# EAGLE design IonSensorRevB (EAGLE 9.6.2)
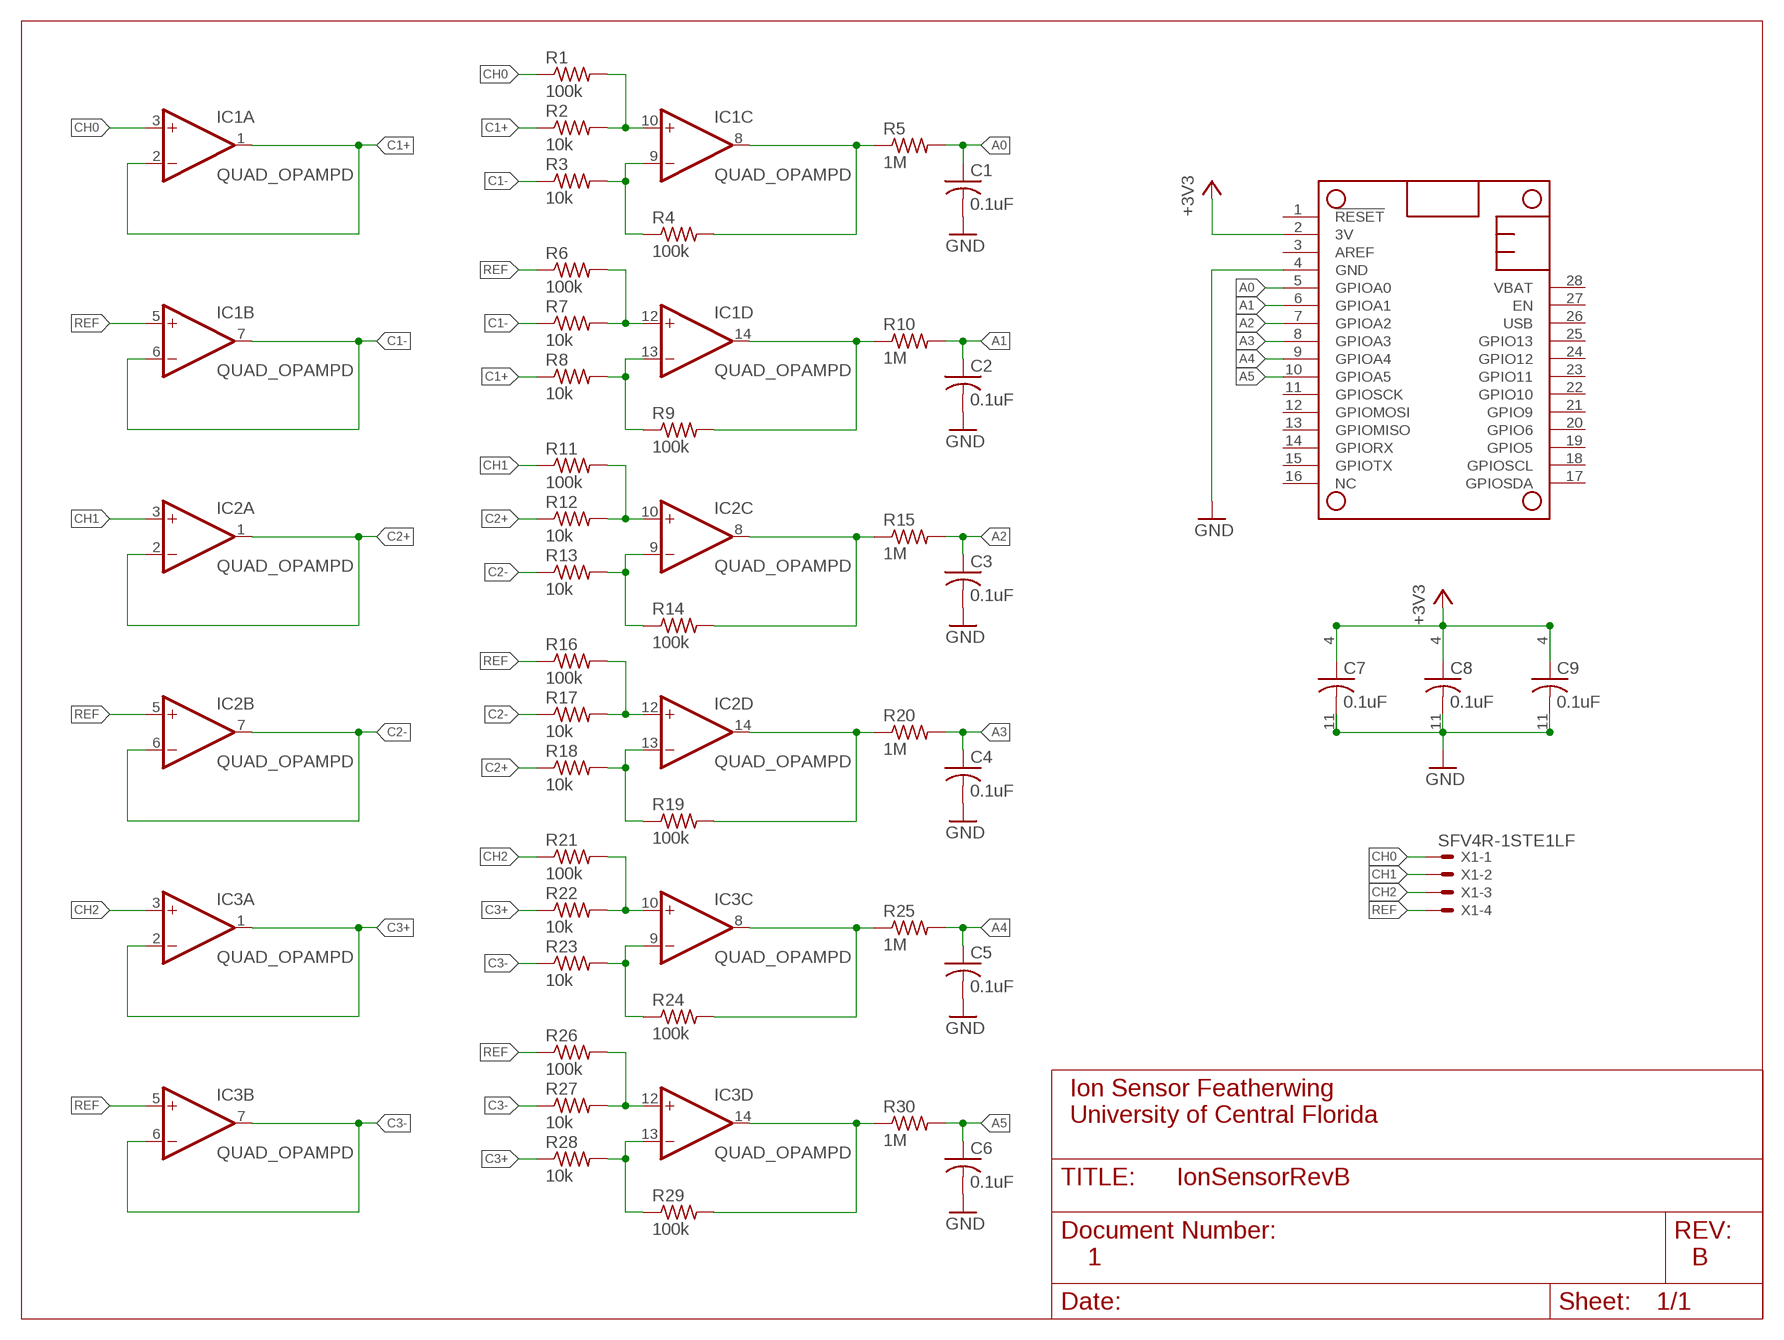
[diagram p0: schematic, sheet 1]

## Parts
C1  0.1uF  C-USC0402  [C0402]
C2  0.1uF  C-USC0402  [C0402]
C3  0.1uF  C-USC0402  [C0402]
C4  0.1uF  C-USC0402  [C0402]
C5  0.1uF  C-USC0402  [C0402]
C6  0.1uF  C-USC0402  [C0402]
C7  0.1uF  C-USC0402  [C0402]
C8  0.1uF  C-USC0402  [C0402]
C9  0.1uF  C-USC0402  [C0402]
IC1  QUAD_OPAMPD  [SO14]
IC2  QUAD_OPAMPD  [SO14]
IC3  QUAD_OPAMPD  [SO14]
MS1  FEATHERWING  [FEATHERWING]
R1  100k  R-US_R0402  [R0402]
R2  10k  R-US_R0402  [R0402]
R3  10k  R-US_R0402  [R0402]
R4  100k  R-US_R0402  [R0402]
R5  1M  R-US_R0402  [R0402]
R6  100k  R-US_R0402  [R0402]
R7  10k  R-US_R0402  [R0402]
R8  10k  R-US_R0402  [R0402]
R9  100k  R-US_R0402  [R0402]
R10  1M  R-US_R0402  [R0402]
R11  100k  R-US_R0402  [R0402]
R12  10k  R-US_R0402  [R0402]
R13  10k  R-US_R0402  [R0402]
R14  100k  R-US_R0402  [R0402]
R15  1M  R-US_R0402  [R0402]
R16  100k  R-US_R0402  [R0402]
R17  10k  R-US_R0402  [R0402]
R18  10k  R-US_R0402  [R0402]
R19  100k  R-US_R0402  [R0402]
R20  1M  R-US_R0402  [R0402]
R21  100k  R-US_R0402  [R0402]
R22  10k  R-US_R0402  [R0402]
R23  10k  R-US_R0402  [R0402]
R24  100k  R-US_R0402  [R0402]
R25  1M  R-US_R0402  [R0402]
R26  100k  R-US_R0402  [R0402]
R27  10k  R-US_R0402  [R0402]
R28  10k  R-US_R0402  [R0402]
R29  100k  R-US_R0402  [R0402]
R30  1M  R-US_R0402  [R0402]
X1  SFV4R-1STE1LF  [SFV4R-1STE1LF]

## Nets
+3V3: C7.1 C8.1 C9.1 IC1.4(P:V+) IC2.4(P:V+) IC3.4(P:V+) MS1.2(3V)
A0: C1.1 MS1.5(GPIOA0) R5.2
A1: C2.1 MS1.6(GPIOA1) R10.2
A2: C3.1 MS1.7(GPIOA2) R15.2
A3: C4.1 MS1.8(GPIOA3) R20.2
A4: C5.1 MS1.9(GPIOA4) R25.2
A5: C6.1 MS1.10(GPIOA5) R30.2
C1+: IC1.1(A:OUT) IC1.2(A:-IN) R2.1 R8.1
C1-: IC1.6(B:-IN) IC1.7(B:OUT) R3.1 R7.1
C2+: IC2.1(A:OUT) IC2.2(A:-IN) R12.1 R18.1
C2-: IC2.6(B:-IN) IC2.7(B:OUT) R13.1 R17.1
C3+: IC3.1(A:OUT) IC3.2(A:-IN) R22.1 R28.1
C3-: IC3.6(B:-IN) IC3.7(B:OUT) R23.1 R27.1
CH0: IC1.3(A:+IN) R1.1 X1.1
CH1: IC2.3(A:+IN) R11.1 X1.2
CH2: IC3.3(A:+IN) R21.1 X1.3
GND: C1.2 C2.2 C3.2 C4.2 C5.2 C6.2 C7.2 C8.2 C9.2 IC1.11(P:V-) IC2.11(P:V-) IC3.11(P:V-) MS1.4(GND)
N$1: IC1.10(C:+IN) R1.2 R2.2
N$2: IC1.9(C:-IN) R3.2 R4.1
N$3: IC3.10(C:+IN) R21.2 R22.2
N$4: IC1.12(D:+IN) R6.2 R7.2
N$5: IC1.8(C:OUT) R4.2 R5.1
N$6: IC1.13(D:-IN) R8.2 R9.1
N$7: IC3.9(C:-IN) R23.2 R24.1
N$8: IC2.10(C:+IN) R11.2 R12.2
N$9: IC2.9(C:-IN) R13.2 R14.1
N$10: IC1.14(D:OUT) R9.2 R10.1
N$11: IC2.12(D:+IN) R16.2 R17.2
N$12: IC3.12(D:+IN) R26.2 R27.2
N$13: IC2.13(D:-IN) R18.2 R19.1
N$14: IC2.8(C:OUT) R14.2 R15.1
N$15: IC3.13(D:-IN) R28.2 R29.1
N$16: IC2.14(D:OUT) R19.2 R20.1
N$17: IC3.8(C:OUT) R24.2 R25.1
N$18: IC3.14(D:OUT) R29.2 R30.1
REF: IC1.5(B:+IN) IC2.5(B:+IN) IC3.5(B:+IN) R6.1 R16.1 R26.1 X1.4
Unconnected: MS1.1(!RESET) MS1.3(AREF) MS1.11(GPIOSCK) MS1.12(GPIOMOSI) MS1.13(GPIOMISO) MS1.14(GPIORX) MS1.15(GPIOTX) MS1.16(NC) MS1.17(GPIOSDA) MS1.18(GPIOSCL) MS1.19(GPIO5) MS1.20(GPIO6) MS1.21(GPIO9) MS1.22(GPIO10) MS1.23(GPIO11) MS1.24(GPIO12) MS1.25(GPIO13) MS1.26(USB) MS1.27(EN) MS1.28(VBAT)

## Notes on the sheet
- Ion Sensor Featherwing
  University of Central Florida
- 1 | B

## Library data of the parts
C1-C9 = adafruit:C-US: CAPACITOR, American symbol
IC1-IC3 = adafruit:QUAD_OPAMP: OP AMP Standard quad package
MS1 = adafruit:FEATHERWING
R1-R30 = adafruit:R-US_: RESISTOR, American symbol
X1 = adafruit:SFV4R-1STE1LF: FPC Connector ZIF for SMT 0.5mm SFV4R-1STE1LF Useful as the LED backlight connector for a PSP display

## Net classes
0 default: width 0.254 mm

## Board
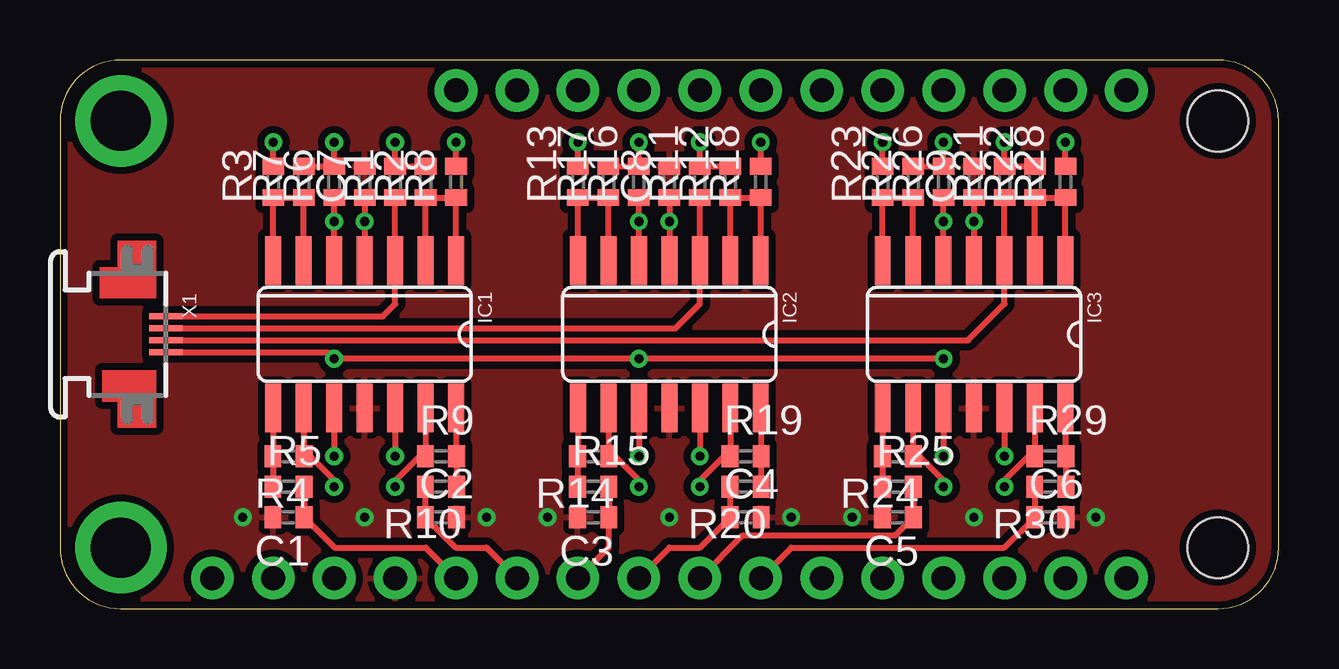
[diagram p1: board, top side]
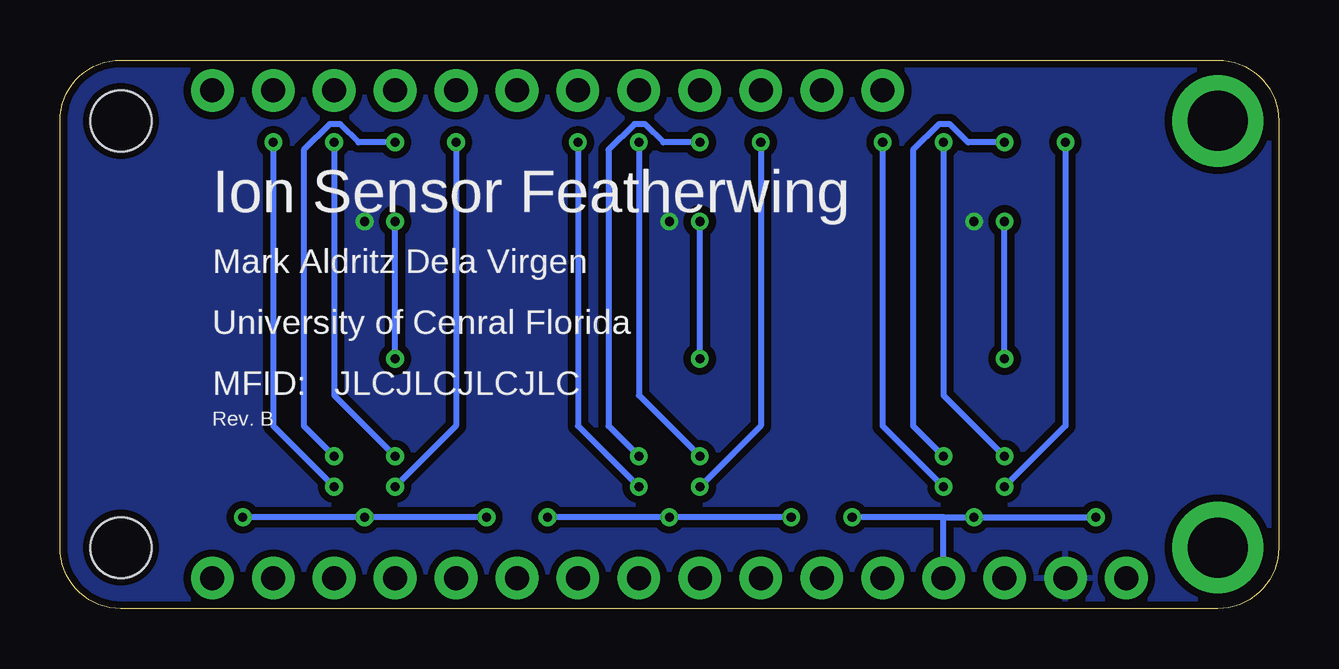
[diagram p2: board, bottom side, seen from below]

Size 50.8 x 22.86 mm. Coordinates in mm from the lower left corner, seen from the top.
Copper layers (1*16): Top 0.035mm / dielectric 1.5mm / Bottom 0.035mm
Design rules "SparkFun-2-Layer-General-JLCPCB": minimum track width 7mil, minimum drill 0.3mm, track to track 7mil, track to pad 7mil, pad to pad 7mil, via to via 7mil, smd to smd 7mil, copper to edge 7mil, drill to drill 7mil, minimum pad ring 7mil, minimum via ring 7mil, stop-mask expansion 3mil, vias tented up to drill 25mil, thermal gap 10mil

### Footprints (pad centres in the part's own frame; a part is rotated, then mirrored left to right if it is on the bottom)
C0402 = smd 0.7 x 0.9: 1 -0.65,0; 2 0.65,0
SO14 = smd 0.66 x 2.032: 1 -3.81,-3.073; 2 -2.54,-3.073; 3 -1.27,-3.073; 4 0,-3.073; 5 1.27,-3.073; 6 2.54,-3.073; 7 3.81,-3.073; 8 3.81,3.073; 9 2.54,3.073; 10 1.27,3.073; 11 0,3.073; 12 -1.27,3.073; 13 -2.54,3.073; 14 -3.81,3.073
FEATHERWING = drill 1 pad 1.778: 1 6.35,1.27; 2 8.89,1.27; 3 11.43,1.27; 4 13.97,1.27; 5 16.51,1.27; 6 19.05,1.27; 7 21.59,1.27; 8 24.13,1.27; 9 26.67,1.27; 10 29.21,1.27; 11 31.75,1.27; 12 34.29,1.27; 13 36.83,1.27; 14 39.37,1.27; 15 41.91,1.27; 16 44.45,1.27; 17 44.45,21.59; 18 41.91,21.59; 19 39.37,21.59; 20 36.83,21.59; 21 34.29,21.59; 22 31.75,21.59; 23 29.21,21.59; 24 26.67,21.59; 25 24.13,21.59; 26 21.59,21.59; 27 19.05,21.59; 28 16.51,21.59 | drill 2.5 pad 3.81: P$1 2.54,20.32; P$2 2.54,2.54 | hole 2.54: 48.26,20.32; 48.26,2.54
R0402 = smd 0.7 x 0.9: 1 -0.65,0; 2 0.65,0
SFV4R-1STE1LF = smd 0.25 x 1.4: 1 -0.75,0.6; 2 -0.25,0.6; 3 0.25,0.6; 4 0.75,0.6

### Placement (x,y rotation side)
C1  9.53,3.81 180 top
C2  15.88,3.81 0 top
C3  22.23,3.81 180 top
C4  28.57,3.81 0 top
C5  34.92,3.81 180 top
C6  41.27,3.81 0 top
C7  12.7,17.78 90 top
C8  25.4,17.78 90 top
C9  38.1,17.78 90 top
IC1  12.7,11.43 180 top
IC2  25.4,11.43 180 top
IC3  38.1,11.43 180 top
MS1  0,0 0 top
R1  13.97,17.78 90 top
R2  15.24,17.78 90 top
R3  8.89,17.78 90 top
R4  9.53,6.35 180 top
R5  9.53,5.08 0 top
R6  11.43,17.78 90 top
R7  10.16,17.78 90 top
R8  16.51,17.78 90 top
R9  15.88,6.35 0 top
R10  15.88,5.08 180 top
R11  26.67,17.78 90 top
R12  27.94,17.78 90 top
R13  21.59,17.78 90 top
R14  22.23,6.35 180 top
R15  22.23,5.08 0 top
R16  24.13,17.78 90 top
R17  22.86,17.78 90 top
R18  29.21,17.78 90 top
R19  28.57,6.35 0 top
R20  28.57,5.08 180 top
R21  39.37,17.78 90 top
R22  40.64,17.78 90 top
R23  34.29,17.78 90 top
R24  34.92,6.35 180 top
R25  34.92,5.08 0 top
R26  36.83,17.78 90 top
R27  35.56,17.78 90 top
R28  41.91,17.78 90 top
R29  41.27,6.35 0 top
R30  41.27,5.08 180 top
X1  3.81,11.43 270 top

### Tracks (layer width: path | path; a pad name or v marks a point on that pad's centre or on a via)
+3V3  (via drill 0.38)
  Top 0.254: C7.1 v12.7,16.13 IC1.4 | C8.1 v25.4,16.13 IC2.4 | C9.1 v38.1,16.13 IC3.4
  pour Bottom (isolate 0.305): 0,0 50.8,0 50.8,22.86 0,22.86
A0
  Top 0.254: R5.2 C1.1 11.45,2.54 15.24,2.54 MS1.5
A1
  Top 0.254: R10.2 C2.1 16.5,2.54 17.78,2.54 MS1.6
A2
  Top 0.254: R15.2 C3.1 22.88,2.56 MS1.7
A3
  Top 0.254: R20.2 C4.1 27.93,3.79 26.67,2.54 25.4,2.54 MS1.8
A4
  Top 0.254: R25.2 C5.1 34.81,3.05 28.45,3.05 MS1.9
A5
  Top 0.254: R30.2 C6.1 40.62,3.79 39.37,2.54 30.48,2.54 MS1.10
C1+
  Top 0.254: IC1.2 R2.1 R8.1 IC1.1
C1-
  Top 0.254: IC1.7 R3.1 R7.1 IC1.6
C2+
  Top 0.254: IC2.2 R12.1 R18.1 IC2.1
C2-
  Top 0.254: IC2.7 R13.1 R17.1 IC2.6
C3+
  Top 0.254: IC3.2 R22.1 R28.1 IC3.1
C3-
  Top 0.254: IC3.7 R23.1 R27.1 IC3.6
CH0
  Top 0.254: R1.1 IC1.3 13.97,12.7 13.45,12.18 X1.1
CH1
  Top 0.254: R11.1 IC2.3 26.67,12.7 25.65,11.68 X1.2
CH2
  Top 0.254: R21.1 IC3.3 39.37,12.7 37.85,11.18 X1.3
GND  (via drill 0.38)
  Bottom 0.254: MS1.4 13.97,3.81 | 13.97,3.81 v12.7,3.81 v7.62,3.81 | 13.97,3.81 v17.78,3.81 | v20.32,3.81 v25.4,3.81 v30.48,3.81 | v33.02,3.81 v38.1,3.81 v43.18,3.81
  pour Top (isolate 0.305): 0,0 50.8,0 50.8,22.86 0,22.86
N$1  (via drill 0.38)
  Top 0.254: R2.2 R1.2 v13.97,19.43 | IC1.10 v11.43,6.35
  Bottom 0.254: v13.97,19.43 13.97,8.89 v11.43,6.35
N$2  (via drill 0.38)
  Top 0.254: IC1.9 10.16,6.37 R4.1 10.43,6.35 11.43,5.35 v11.43,5.08 | R3.2 v8.89,19.43
  Bottom 0.254: v11.43,5.08 8.89,7.62 v8.89,19.43
N$3  (via drill 0.38)
  Top 0.254: R22.2 R21.2 v39.37,19.43 | IC3.10 v36.83,6.35
  Bottom 0.254: v39.37,19.43 39.37,8.89 v36.83,6.35
N$4  (via drill 0.38)
  Top 0.254: R7.2 R6.2 v11.43,19.43 | IC1.12 v13.97,6.35
  Bottom 0.254: v13.97,6.35 15.24,7.62 15.24,19.11 14.16,20.19 13.72,20.19 12.95,19.43 v11.43,19.43
N$5
  Top 0.254: IC1.8 8.89,6.37 R4.2 R5.1
N$6  (via drill 0.38)
  Top 0.254: IC1.13 15.24,6.37 R9.1 14.99,6.35 13.97,5.33 v13.97,5.08 | R8.2 v16.51,19.43
  Bottom 0.254: v16.51,19.43 16.51,7.62 v13.97,5.08
N$7  (via drill 0.38)
  Top 0.254: IC3.9 35.56,6.37 R24.1 35.83,6.35 36.83,5.35 v36.83,5.08 | R23.2 v34.29,19.43
  Bottom 0.254: v36.83,5.08 34.29,7.62 v34.29,19.43
N$8  (via drill 0.38)
  Top 0.254: R12.2 R11.2 v26.67,19.43 | IC2.10 v24.13,6.35
  Bottom 0.254: v26.67,19.43 26.67,8.89 v24.13,6.35
N$9  (via drill 0.38)
  Top 0.254: IC2.9 22.86,6.37 R14.1 23.13,6.35 24.13,5.35 v24.13,5.08 | R13.2 v21.59,19.43
  Bottom 0.254: v24.13,5.08 21.59,7.62 v21.59,19.43
N$10
  Top 0.254: IC1.14 16.51,6.37 R9.2 R10.1
N$11  (via drill 0.38)
  Top 0.254: R17.2 R16.2 v24.13,19.43 | IC2.12 v26.67,6.35
  Bottom 0.254: v26.67,6.35 27.94,7.62 27.94,19.11 26.86,20.19 26.42,20.19 25.65,19.43 v24.13,19.43
N$12  (via drill 0.38)
  Top 0.254: R27.2 R26.2 v36.83,19.43 | IC3.12 v39.37,6.35
  Bottom 0.254: v39.37,6.35 40.64,7.62 40.64,19.11 39.56,20.19 39.12,20.19 38.35,19.43 v36.83,19.43
N$13  (via drill 0.38)
  Top 0.254: IC2.13 27.94,6.37 R19.1 27.67,6.35 26.67,5.35 v26.67,5.08 | R18.2 v29.21,19.43
  Bottom 0.254: v29.21,19.43 29.21,7.62 v26.67,5.08
N$14
  Top 0.254: IC2.8 21.59,6.37 R14.2 R15.1
N$15  (via drill 0.38)
  Top 0.254: IC3.13 40.64,6.37 R29.1 40.37,6.35 39.37,5.35 v39.37,5.08 | R28.2 v41.91,19.43
  Bottom 0.254: v41.91,19.43 41.91,7.62 v39.37,5.08
N$16
  Top 0.254: IC2.14 29.21,6.37 R19.2 R20.1
N$17
  Top 0.254: IC3.8 34.29,6.37 R24.2 R25.1
N$18
  Top 0.254: IC3.14 41.91,6.37 R29.2 R30.1
REF  (via drill 0.38)
  Top 0.254: IC1.5 v11.43,16.13 R6.1 | IC2.5 v24.13,16.13 R16.1 | IC3.5 v36.83,16.13 R26.1 | X1.4 11.16,10.68 v11.43,10.41 v24.13,10.41 v36.83,10.41
  Bottom 0.254: v11.43,10.41 v11.43,16.13 | v24.13,10.41 v24.13,16.13 | v36.83,10.41 v36.83,16.13

### Text on the board
bPlace: Ion Sensor Featherwing | Mark Aldritz Dela Virgen | University of Cenral Florida | JLCJLCJLCJLC | MFID: | Rev. B